# EAGLE design extruder-controller (EAGLE 5.06)
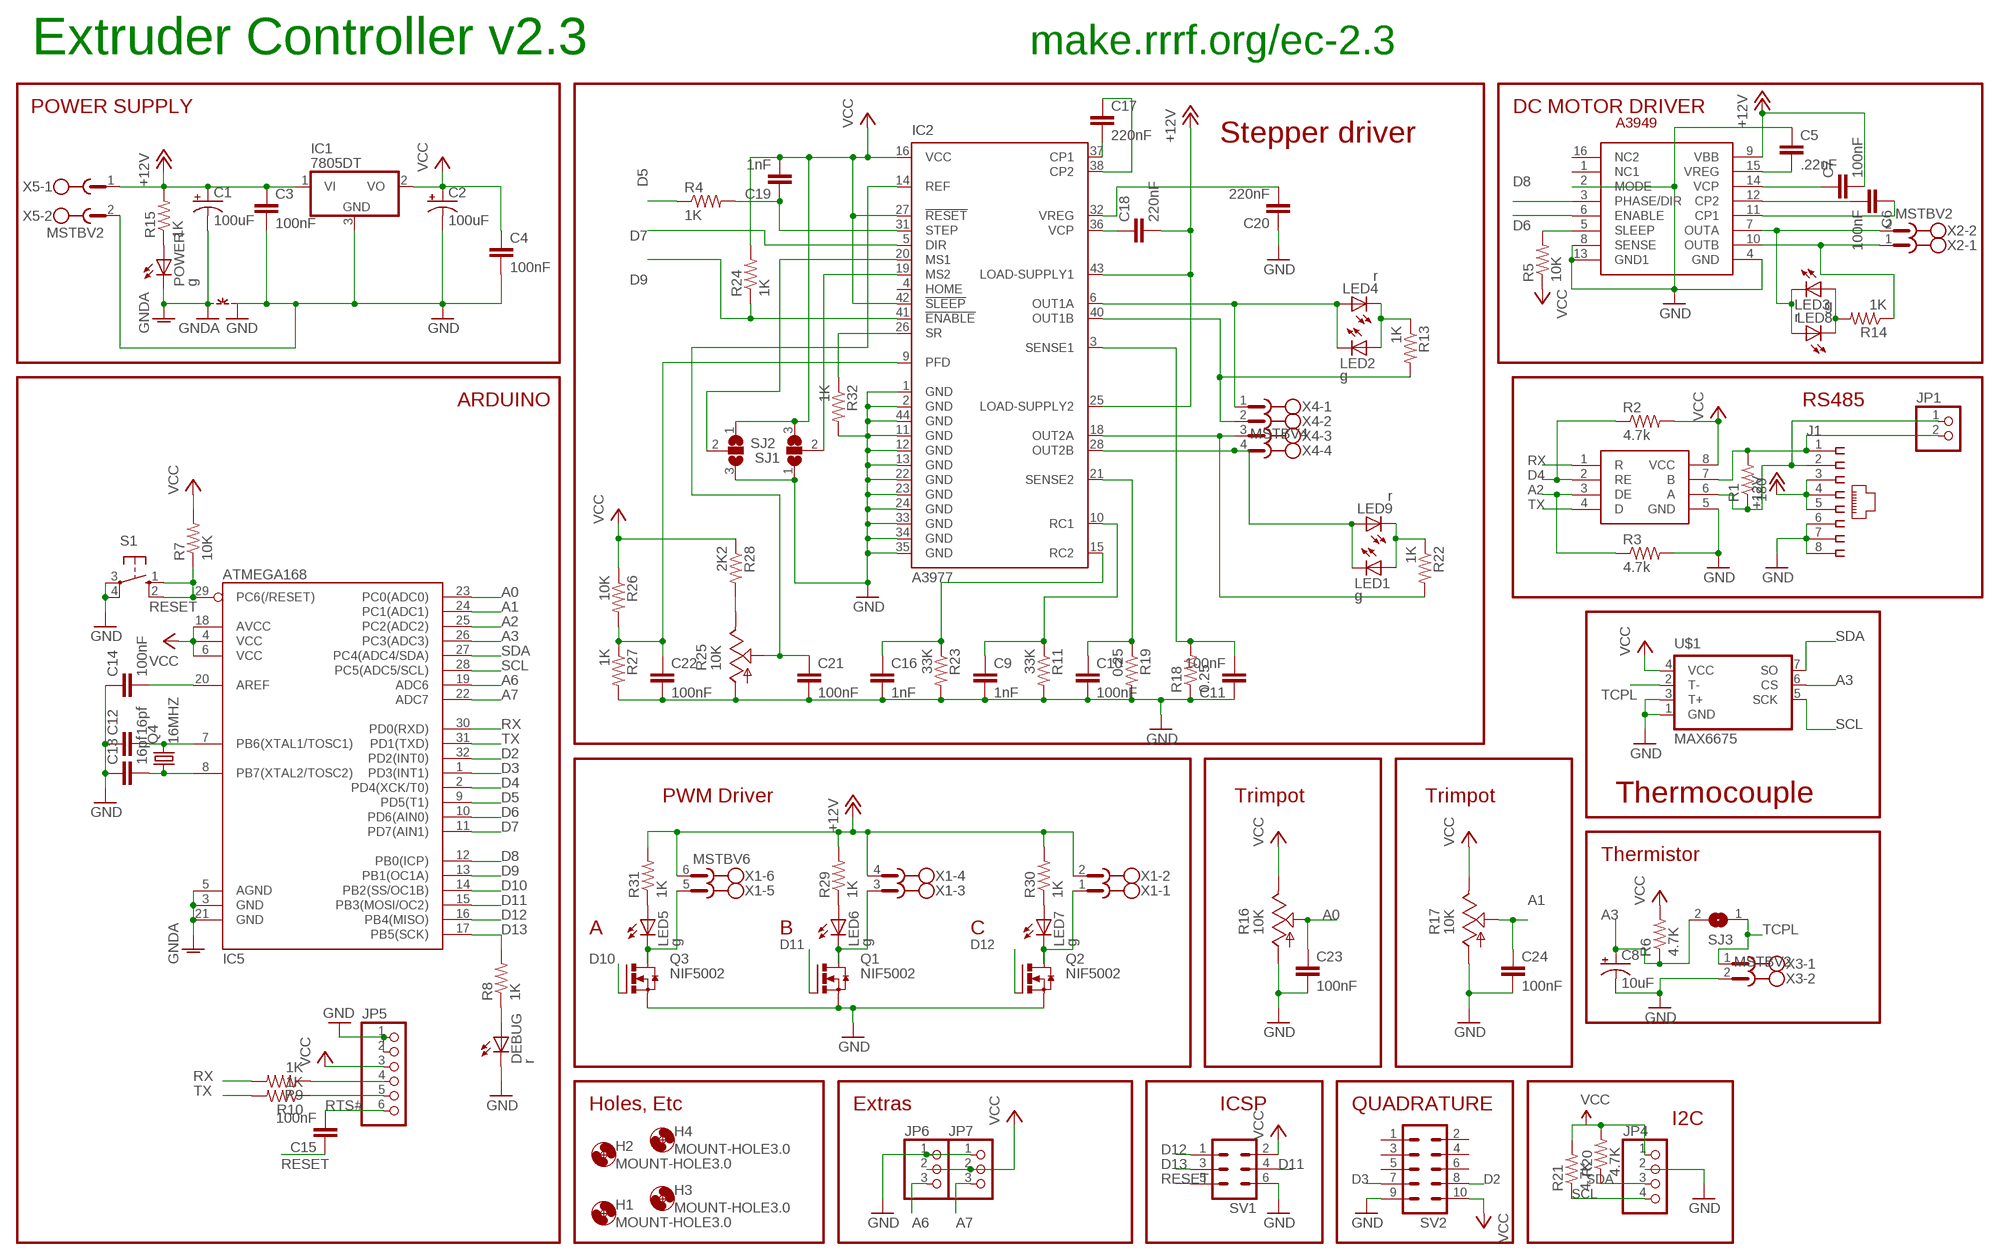
[diagram p0: schematic, sheet 1]

## Parts
C1  100uF  CPOL-USUD-10X10  [UD-10X10_NICHICON]
C2  100uF  CPOL-USUD-10X10  [UD-10X10_NICHICON]
C3  100nF  C-EUC1206  [C1206]
C4  100nF  C-EUC1206  [C1206]
C5  .22uF  C-EUC1206K  [C1206K]
C6  100nF  C-EUC1206K  [C1206K]
C7  100nF  C-EUC1206K  [C1206K]
C8  10uF  CPOL-USUD-6,3X5,8  [UD-6,3X5,8_NICHICON]
C9  1nF  C-EUC1206K  [C1206K]
C10  100nF  C-EUC1206K  [C1206K]
C11  100nF  C-EUC1206K  [C1206K]
C12  16pf  C-EUC1206  [C1206]
C13  16pf  C-EUC1206  [C1206]
C14  100nF  C-EUC1206  [C1206]
C15  100nF  C-EUC1206  [C1206]
C16  1nF  C-EUC1206K  [C1206K]
C17  220nF  C-EUC1206K  [C1206K]
C18  220nF  C-EUC1206K  [C1206K]
C19  1nF  C-EUC1206K  [C1206K]
C20  220nF  C-EUC1206K  [C1206K]
C21  100nF  C-EUC1206K  [C1206K]
C22  100nF  C-EUC1206K  [C1206K]
C23  100nF  C-EUC1206K  [C1206K]
C24  100nF  C-EUC1206K  [C1206K]
DEBUG  r  LEDCHIPLED_1206  [CHIPLED_1206]
H1  MOUNT-HOLE3.0  [3,0]
H2  MOUNT-HOLE3.0  [3,0]
H3  MOUNT-HOLE3.0  [3,0]
H4  MOUNT-HOLE3.0  [3,0]
IC1  7805DT  [TO252]
IC2  A3977  [PLCC44]
IC3  A3949  [SO16W]
IC4  SN75176ASOIC  [SO08]
IC5  ATMEGA168  [TQFP32-08]
J1  520426-4  [520426-4]
JP1  PINHD-1X2  [1X02]
JP4  PINHD-1X4  [1X04]
JP5  PINHD-1X6  [1X06]
JP6  PINHD-1X3  [1X03]
JP7  PINHD-1X3  [1X03]
LED1  g  LEDCHIPLED_1206  [CHIPLED_1206]
LED2  g  LEDCHIPLED_1206  [CHIPLED_1206]
LED3  r  LEDCHIPLED_1206  [CHIPLED_1206]
LED4  r  LEDCHIPLED_1206  [CHIPLED_1206]
LED5  g  LEDCHIPLED_1206  [CHIPLED_1206]
LED6  g  LEDCHIPLED_1206  [CHIPLED_1206]
LED7  g  LEDCHIPLED_1206  [CHIPLED_1206]
LED8  g  LEDCHIPLED_1206  [CHIPLED_1206]
LED9  r  LEDCHIPLED_1206  [CHIPLED_1206]
POWER  g  LEDCHIPLED_1206  [CHIPLED_1206]
Q1  NIF5002  N-HEXFET-2D_SOT232-  [SOT223]
Q2  NIF5002  N-HEXFET-2D_SOT232-  [SOT223]
Q3  NIF5002  N-HEXFET-2D_SOT232-  [SOT223]
Q4  16MHZ  CRYSTALHC49S  [HC49/S]
R1  180  R-US_R1206  [R1206]
R2  4.7k  R-US_R1206  [R1206]
R3  4.7k  R-US_R1206  [R1206]
R4  1K  R-US_R1206  [R1206]
R5  10K  R-US_R1206  [R1206]
R6  4.7K  R-US_M1206  [M1206]
R7  10K  R-US_R1206  [R1206]
R8  1K  R-US_R1206  [R1206]
R9  1K  R-US_R1206  [R1206]
R10  1K  R-US_R1206  [R1206]
R11  33K  R-US_R1206  [R1206]
R13  1K  R-US_R1206  [R1206]
R14  1K  R-US_R1206  [R1206]
R15  1K  R-US_R1206  [R1206]
R16  10K  TRIM_US-B25P  [B25P]
R17  10K  TRIM_US-B25P  [B25P]
R18  0.25  R-US_R2512  [R2512]
R19  0.25  R-US_R2512  [R2512]
R20  4.7K  R-US_R1206  [R1206]
R21  4.7K  R-US_R1206  [R1206]
R22  1K  R-US_R1206  [R1206]
R23  33K  R-US_R1206  [R1206]
R24  1K  R-US_R1206  [R1206]
R25  10K  TRIM_US-B25P  [B25P]
R26  10K  R-US_R1206  [R1206]
R27  1K  R-US_R1206  [R1206]
R28  2K2  R-US_R1206  [R1206]
R29  1K  R-US_R1206  [R1206]
R30  1K  R-US_R1206  [R1206]
R31  1K  R-US_M1206  [M1206]
R32  1K  R-US_R1206  [R1206]
S1  10-XX  [B3F-10XX]
SJ1  SJ2W  [SJ_2]
SJ2  SJ2W  [SJ_2]
SJ3  SJ  [SJ]
SV1  ML6  [ML6]
SV2  ML10  [ML10]
U$1  MAX6675  [SO08]
X1  MSTBV6  [MSTBV6]
X2  MSTBV2  [MSTBV2]
X3  MSTBV2  [MSTBV2]
X4  MSTBV4  [MSTBV4]
X5  MSTBV2  [MSTBV2]
~NUDEV~1  GND-GNDA  [GND-GNDA]

## Nets
+12V [power]: C1.+ C3.1 C7.2 C18.2 IC1.1(VI) IC2.25(LOAD-SUPPLY2) IC2.43(LOAD-SUPPLY1) IC3.9(VBB) J1.3 J1.4 J1.5 R15.2 R29.2 R30.2 R31.2 X1.2 X1.4 X1.6 X5.1
A0: C23.1 IC5.23(PC0(ADC0)) R16.S
A1: C24.1 IC5.24(PC1(ADC1)) R17.S
A2: IC4.3(DE) IC5.25(PC2(ADC2)) R3.1
A3: C8.+ IC5.26(PC3(ADC3)) R6.1 SJ3.2 U$1.6(CS)
A6: IC5.19(ADC6) JP6.3
A7: IC5.22(ADC7) JP7.3
D2: IC5.32(PD2(INT0)) SV2.8
D3: IC5.1(PD3(INT1)) SV2.7
D4: IC4.2(RE) IC5.2(PD4(XCK/T0)) R2.1
D5: IC5.9(PD5(T1)) R4.1
D6: IC3.6(ENABLE) IC5.10(PD6(AIN0))
D7: IC2.5(DIR) IC5.11(PD7(AIN1))
D8: IC3.3(PHASE/DIR) IC5.12(PB0(ICP))
D9: IC2.41(!ENABLE) IC5.13(PB1(OC1A)) R24.1
D10: IC5.14(PB2(SS/OC1B)) Q3.1(G)
D11: IC5.15(PB3(MOSI/OC2)) Q1.1(G) SV1.4
D12: IC5.16(PB4(MISO)) Q2.1(G) SV1.1
D13: IC5.17(PB5(SCK)) R8.2 SV1.3
GND [power]: C2.- C3.2 C4.2 C5.1 C8.- C9.2 C10.2 C11.1 C12.1 C13.1 C14.1 C16.2 C20.1 C21.2 C22.2 C23.2 C24.2 DEBUG.C IC1.3(GND) IC2.1(GND) IC2.2(GND) IC2.11(GND) IC2.12(GND) IC2.13(GND) IC2.22(GND) IC2.23(GND) IC2.24(GND) IC2.33(GND) IC2.34(GND) IC2.35(GND) IC2.44(GND) IC3.2(MODE) IC3.4(GND) IC3.8(SENSE) IC3.13(GND1) IC4.5(GND) J1.6 J1.7 J1.8 JP4.2 JP5.1 JP5.2 JP6.1 JP7.1 Q1.3(S) Q2.3(S) Q3.3(S) R3.2 R11.2 R16.A R17.A R18.1 R19.2 R23.2 R25.A R27.2 R32.2 S1.3(P) S1.4(P1) SJ1.1 SJ2.3 SV1.6 SV2.9 U$1.1(GND) U$1.3(T+) X3.2 X5.2 ~NUDEV~1.GND
GNDA: C1.- IC5.3(GND) IC5.5(AGND) IC5.21(GND) POWER.C ~NUDEV~1.GNDA
N$1: IC4.7(B) J1.1 JP1.2 R1.2
N$2: IC4.6(A) J1.2 JP1.1 R1.1
N$3 [motors]: IC2.6(OUT1A) LED2.C LED4.A X4.1
N$4 [motors]: IC2.40(OUT1B) R13.2 X4.2
N$5: C19.1 IC2.31(STEP) R4.2
N$6 [power]: IC3.7(OUTA) LED3.C LED8.A X2.2
N$7: LED2.A LED4.C R13.1
N$8: DEBUG.A R8.1
N$9: C9.1 IC2.10(RC1) R11.1
N$11: C5.2 IC3.15(VREG)
N$12: C16.1 IC2.15(RC2) R23.1
N$13: C6.2 IC3.12(CP2)
N$14: C6.1 IC3.11(CP1)
N$15: C7.1 IC3.14(VCP)
N$16: IC3.5(SLEEP) R5.2
N$17 [motors]: IC3.10(OUTB) R14.1 X2.1
N$18 [motors]: C11.2 IC2.3(SENSE1) R18.2
N$20: C14.2 IC5.20(AREF)
N$21: JP5.5 R10.1
N$22: JP5.4 R9.1
N$23: LED1.A LED9.C R22.1
N$24: LED3.A LED8.C R14.2
N$25: POWER.A R15.1
N$26 [motors]: IC2.28(OUT2B) LED1.C LED9.A X4.4
N$27 [motors]: IC2.18(OUT2A) R22.2 X4.3
N$28: IC2.26(SR) R32.1
N$30 [motors]: C10.1 IC2.21(SENSE2) R19.1
N$31: C12.2 IC5.7(PB6(XTAL1/TOSC1)) Q4.2
N$32: C13.2 IC5.8(PB7(XTAL2/TOSC2)) Q4.1
N$33 [power]: LED7.C Q2.2(D) Q2.4(D) X1.1
N$34 [power]: LED6.C Q1.2(D) Q1.4(D) X1.3
N$35 [power]: LED5.C Q3.2(D) Q3.4(D) X1.5
N$36: C18.1 IC2.36(VCP)
N$37: C20.2 IC2.32(VREG)
N$38: C17.2 IC2.37(CP1)
N$39: C17.1 IC2.38(CP2)
N$41: LED5.A R31.1
N$42: LED6.A R29.1
N$43: LED7.A R30.1
N$45: C22.1 IC2.9(PFD) R26.2 R27.1
N$46: IC2.19(MS2) SJ1.2
N$47: IC2.20(MS1) SJ2.2
N$48: R25.E R28.2
N$49: C21.1 IC2.14(REF) R25.S
RESET: C15.1 IC5.29(PC6(/RESET)) R7.1 S1.1(S) S1.2(S1) SV1.5
RTS#: C15.2 JP5.6
RX: IC4.1(R) IC5.30(PD0(RXD)) R9.2
SCL: IC5.28(PC5(ADC5/SCL)) JP4.4 R21.1 U$1.5(SCK)
SDA: IC5.27(PC4(ADC4/SDA)) JP4.3 R20.1 U$1.7(SO)
TCPL: SJ3.1 U$1.2(T-) X3.1
TX: IC4.4(D) IC5.31(PD1(TXD)) R10.2
VCC: C2.+ C4.1 C19.2 IC1.2(VO) IC2.16(VCC) IC2.27(!RESET) IC2.42(!SLEEP) IC4.8(VCC) IC5.4(VCC) IC5.6(VCC) IC5.18(AVCC) JP4.1 JP5.3 JP6.2 JP7.2 R2.2 R5.1 R6.2 R7.2 R16.E R17.E R20.2 R21.2 R24.2 R26.1 R28.1 SJ1.3 SJ2.1 SV1.2 SV2.10 U$1.4(VCC)
Unconnected: IC2.4(HOME) IC3.1(NC1) IC3.16(NC2) SV2.1 SV2.2 SV2.3 SV2.4 SV2.5 SV2.6

## Notes on the sheet
- make.rrrf.org/ec-2.3
- Extruder Controller v2.3
- POWER SUPPLY | DC MOTOR DRIVER
- Stepper driver
- ARDUINO | RS485
- PWM Driver | Trimpot | Trimpot | Thermocouple
- Thermistor
- A | B | C
- Holes, Etc | Extras | ICSP | QUADRATURE | I2C

## Library data of the parts
C1 C2 C8 = rcl:CPOL-US: POLARIZED CAPACITOR, American symbol
C3-C7 C9-C11 C14 C16-C24 = rcl:C-EU: CAPACITOR, European symbol
C12 C13 C15 = resistor:C-EU: CAPACITOR, European symbol
DEBUG LED1-LED9 POWER = led:LED: LED OSRAM: - CHIPLED LG R971, LG N971, LY N971, LG Q971, LY Q971, LO R971, LY R971 LH N974, LH R974 LS Q976, LO Q976, LY Q976 LO Q996 - Hyper CHIPLED LW Q18S LB Q993, LB Q99A, LB R99A - SideLED LS A670, LO A670, LY A670, LG A670, LP A670 LB A673, LV A673, LT A673, LW A673 LH A674 LY A675 LS A676, LA A676, LO A676, LY A676, LW A676 LS A679, LY A679, LG A679 - Hyper Micro SIDELED® LS Y876, LA Y876, LO Y876, LY Y876 LT Y87S - SmartLED LW L88C, LW L88S LB L89C, LB L89S, LG L890 LS L89K, LO L89K, LY L89K LS L896, LA L896, LO L896, LY L896 - TOPLED LS T670, LO T670, LY T670, LG T670, LP T670 LSG T670, LSP T670, LSY T670, LOP T670, LYG T670 LG T671, LOG T671, LSG T671 LB T673, LV T673, LT T673, LW T673 LH T674 LS T676, LA T676, LO T676, LY T676, LB T676, LH T676, LSB T676, LW T676 LB T67C, LV T67C, LT T67C, LS T67K, LO T67K, LY T67K, LW E67C LS E67B, LA E67B, LO E67B, LY E67B, LB E67C, LV E67C, LT E67C LW T67C LS T679, LY T679, LG T679 LS T770, LO T770, LY T770, LG T770, LP T770 LB T773, LV T773, LT T773, LW T773 LH T774 LS E675, LA E675, LY E675, LS T675 LS T776, LA T776, LO T776, LY T776, LB T776 LHGB T686 LT T68C, LB T68C - Hyper Mini TOPLED® LB M676 - Mini TOPLED Santana® LG M470 LS M47K, LO M47K, LY M47K Source: http://www.osram.convergy.de - LUMILED® LXK2-PW12-R00, LXK2-PW12-S00, LXK2-PW14-U00, LXK2-PW14-V00 LXK2-PM12-R00, LXK2-PM12-S00, LXK2-PM14-U00 LXK2-PE12-Q00, LXK2-PE12-R00, LXK2-PE12-S00, LXK2-PE14-T00, LXK2-PE14-U00 LXK2-PB12-K00, LXK2-PB12-L00, LXK2-PB12-M00, LXK2-PB14-N00, LXK2-PB14-P00, LXK2-PB14-Q00 LXK2-PR12-L00, LXK2-PR12-M00, LXK2-PR14-Q00, LXK2-PR14-R00 LXK2-PD12-Q00, LXK2-PD12-R00, LXK2-PD12-S00 LXK2-PH12-R00, LXK2-PH12-S00 LXK2-PL12-P00, LXK2-PL12-Q00, LXK2-PL12-R00 Source: www.luxeon.com
H1-H4 = holes:MOUNT-HOLE: MOUNTING HOLE with drill center marker
IC1 = linear:78*: Positive VOLTAGE REGULATOR Source: http://cache.national.com/ds/LM/LM78L05.pdf http://www.fairchildsemi.com/ds/LM/LM7805.pdf
IC2 = allegro:A3977: MICROSTEPPING DMOS DRIVER WITH TRANSLATOR Source: 3977.pdf
IC3 = reprap:A3949
IC4 = reprap:SN75176A
IC5 = SparkFun:ATMEGA168
J1 = con-amp:520426-4: AMP connector
JP1 = pinhead:PINHD-1X2: PIN HEADER
JP4 = pinhead:PINHD-1X4: PIN HEADER
JP5 = pinhead:PINHD-1X6: PIN HEADER
JP6 JP7 = pinhead:PINHD-1X3: PIN HEADER
Q1-Q3 = transistor-power:N-HEXFET-2D_?-*: HEXFET® Power MOSFET 2 Drain connects http://www.irf.com/product-info/datasheets/data/irll014n.pdf
Q4 = crystal:CRYSTAL: CRYSTAL
R1-R3 R5 R7-R10 R15 = resistor:R-US_: RESISTOR, American symbol
R4 R6 R11 R13 R14 R18-R24 R26-R32 = rcl:R-US_: RESISTOR, American symbol
R16 R17 R25 = pot:TRIM_US-: POTENTIOMETER
S1 = switch-omron:10-XX: OMRON SWITCH
SJ1 SJ2 = jumper:SJ2W: SMD solder JUMPER
SJ3 = jumper:SJ: SMD solder JUMPER
SV1 = con-harting-ml:ML6: HARTING
SV2 = con-harting-ml:ML10: HARTING
U$1 = reprap:MAX6675: K-type thermocouple amplifier and a->d converter
X1 = con-phoenix-508:MSTBV6: PHOENIX
X2 X3 X5 = con-phoenix-508:MSTBV2: PHOENIX
X4 = con-phoenix-508:MSTBV4: PHOENIX
~NUDEV~1 = supply1:GND-GNDA: Example of GND--GNDA NET-Connetor for more info see description in package

## Net classes
0 default: width 0.305 mm
1 power: width 1.27 mm
2 motors: width 0.762 mm

## Board
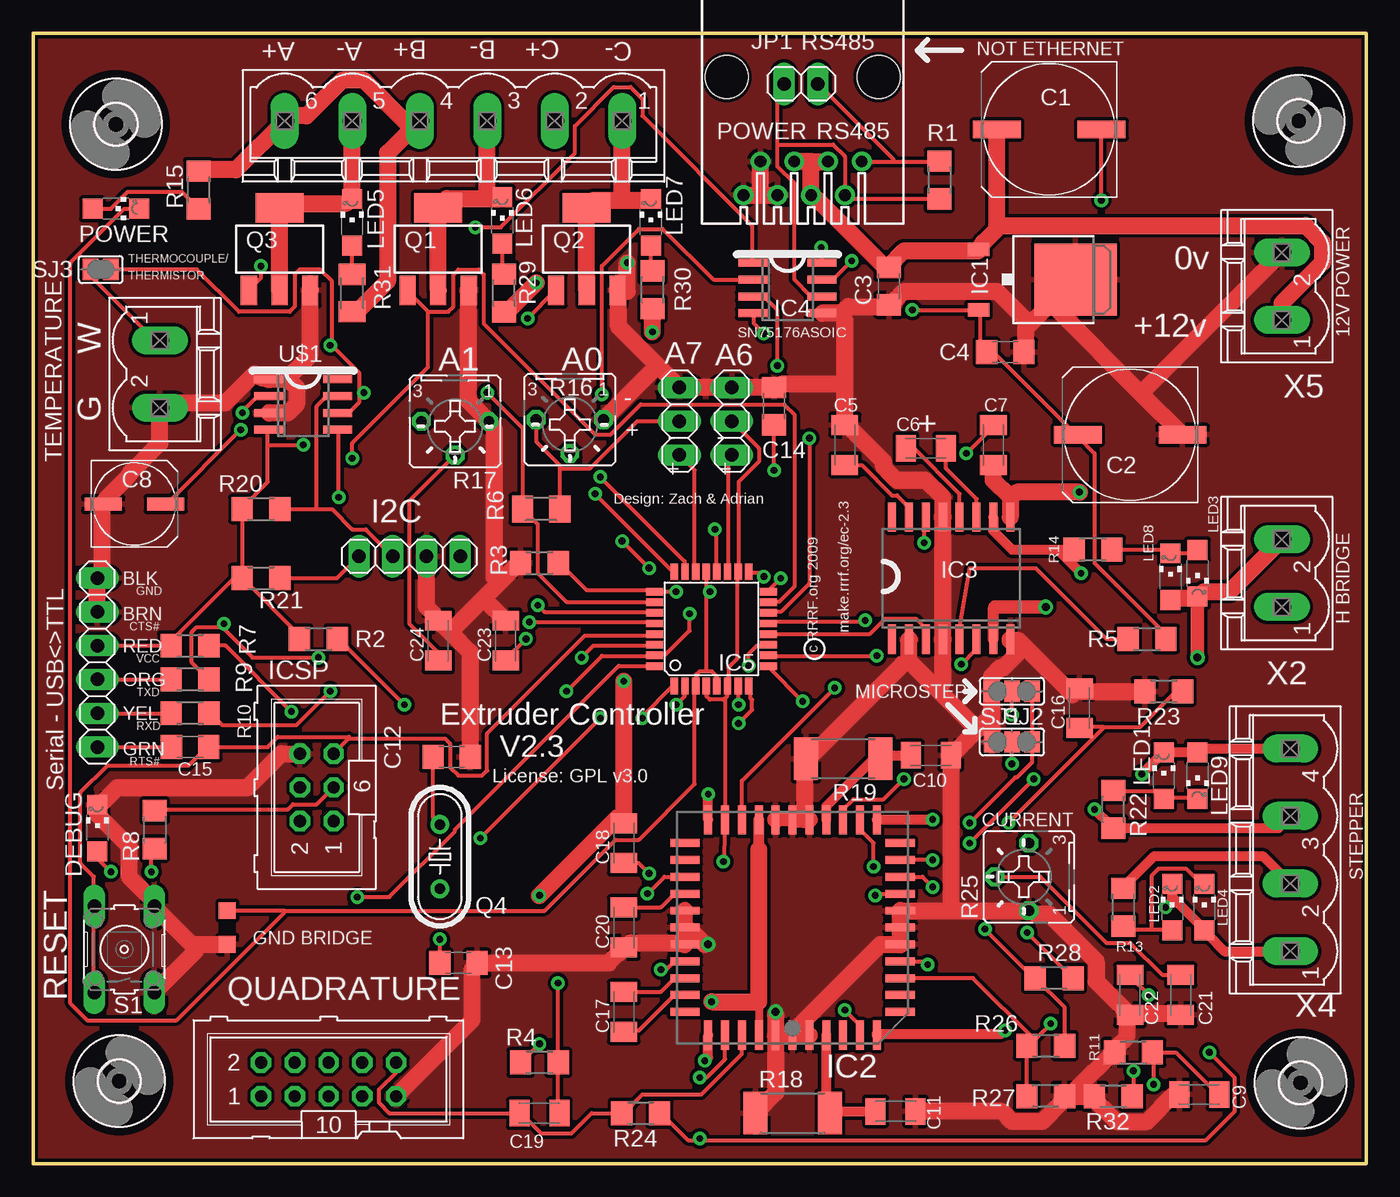
[diagram p1: board, top side]
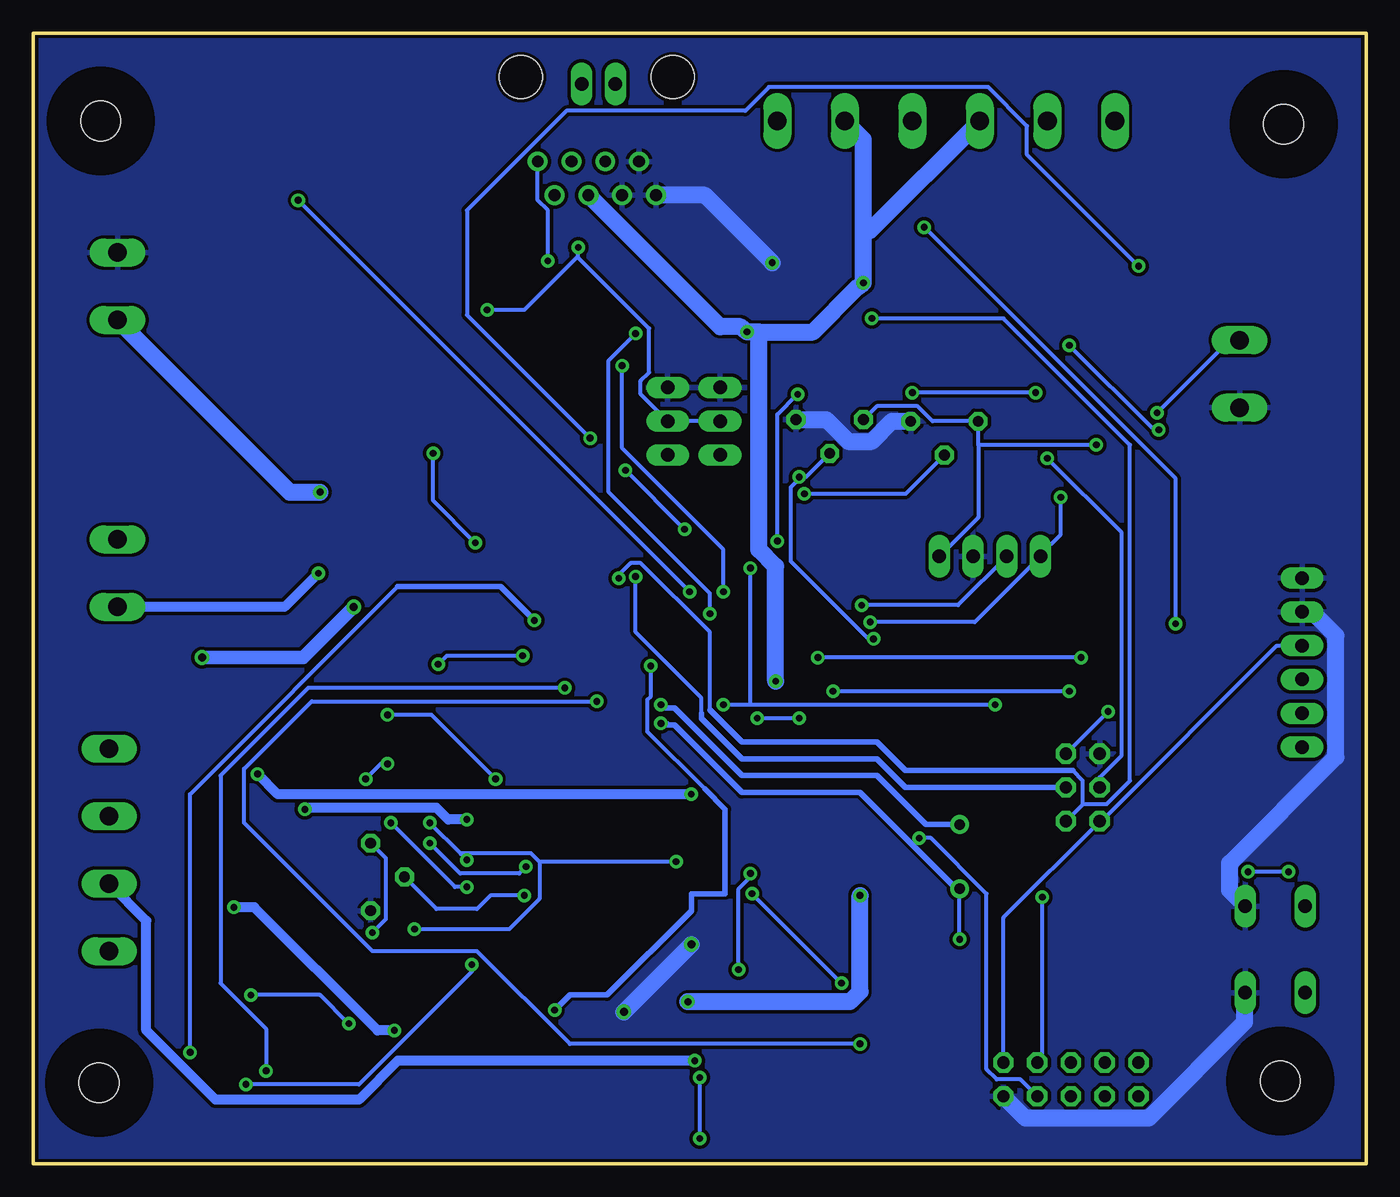
[diagram p2: board, bottom side, seen from below]

Size 100.33 x 85.09 mm. Coordinates in mm from the lower left corner, seen from the top.
Outline: 0,85.09 100.33,85.09 100.33,0 0,0 0,85.09
Copper layers (1*16): Top 0.035mm / dielectric 1.5mm / Bottom 0.035mm
Design rules "reprap": minimum track width 8mil, minimum drill 20mil, track to track 10mil, track to pad 10mil, pad to pad 10mil, via to via 10mil, smd to smd 8mil, copper to edge 10mil, drill to drill 8mil, minimum pad ring 12mil, minimum via ring 10mil, stop-mask expansion 4mil, vias tented up to drill 25mil, thermal gap 10mil

### Footprints (pad centres in the part's own frame; a part is rotated, then mirrored left to right if it is on the bottom)
UD-10X10_NICHICON = smd 3.6 x 1.3: + 3.925,0; - -3.95,0
C1206 = smd 1.6 x 1.8: 1 -1.4,0; 2 1.4,0
C1206K = smd 1.5 x 2: 1 -1.5,0; 2 1.5,0
UD-6,3X5,8_NICHICON = smd 2.8 x 1: + 2.35,0; - -2.35,0
CHIPLED_1206 = smd 1.5 x 1.5: A 0,-1.75; C 0,1.75
3,0 = hole 3: 0,0
TO252 = smd 1 x 1.6: 1 -2.28,-4.8; 2 2.28,-4.8 | smd 5.4 x 6.2: 3 0,2.5
PLCC44 = smd 0.6 x 2.2: 1 0,8.1; 2 -1.27,8.1; 3 -2.54,8.1; 4 -3.81,8.1; 5 -5.08,8.1; 6 -6.35,8.1; 18 -6.35,-8.1; 19 -5.08,-8.1; 20 -3.81,-8.1; 21 -2.54,-8.1; 22 -1.27,-8.1; 23 0,-8.1; 24 1.27,-8.1; 25 2.54,-8.1; 26 3.81,-8.1; 27 5.08,-8.1; 28 6.35,-8.1; 40 6.35,8.1; 41 5.08,8.1; 42 3.81,8.1; 43 2.54,8.1; 44 1.27,8.1 | smd 2.2 x 0.6: 7 -8.1,6.35; 8 -8.1,5.08; 9 -8.1,3.81; 10 -8.1,2.54; 11 -8.1,1.27; 12 -8.1,0; 13 -8.1,-1.27; 14 -8.1,-2.54; 15 -8.1,-3.81; 16 -8.1,-5.08; 17 -8.1,-6.35; 29 8.1,-6.35; 30 8.1,-5.08; 31 8.1,-3.81; 32 8.1,-2.54; 33 8.1,-1.27; 34 8.1,0; 35 8.1,1.27; 36 8.1,2.54; 37 8.1,3.81; 38 8.1,5.08; 39 8.1,6.35
SO16W = smd 0.6 x 2.2: 1 -4.445,-4.6; 2 -3.175,-4.6; 3 -1.905,-4.6; 4 -0.635,-4.6; 5 0.635,-4.6; 6 1.905,-4.6; 7 3.175,-4.6; 8 4.445,-4.6; 9 4.445,4.6; 10 3.175,4.6; 11 1.905,4.6; 12 0.635,4.6; 13 -0.635,4.6; 14 -1.905,4.6; 15 -3.175,4.6; 16 -4.445,4.6
SO08 = smd 0.6 x 2.2: 1 -1.905,-2.6; 2 -0.635,-2.6; 3 0.635,-2.6; 4 1.905,-2.6; 5 1.905,2.6; 6 0.635,2.6; 7 -0.635,2.6; 8 -1.905,2.6
TQFP32-08 = smd 1.27 x 0.559: 1 -4.293,2.8; 2 -4.293,2; 3 -4.293,1.2; 4 -4.293,0.4; 5 -4.293,-0.4; 6 -4.293,-1.2; 7 -4.293,-2; 8 -4.293,-2.8; 17 4.293,-2.8; 18 4.293,-2; 19 4.293,-1.2; 20 4.293,-0.4; 21 4.293,0.4; 22 4.293,1.2; 23 4.293,2; 24 4.293,2.8 | smd 0.559 x 1.27: 9 -2.8,-4.293; 10 -2,-4.293; 11 -1.2,-4.293; 12 -0.4,-4.293; 13 0.4,-4.293; 14 1.2,-4.293; 15 2,-4.293; 16 2.8,-4.293; 25 2.8,4.293; 26 2,4.293; 27 1.2,4.293; 28 0.4,4.293; 29 -0.4,4.293; 30 -1.2,4.293; 31 -2,4.293; 32 -2.8,4.293
520426-4 = drill 0.889 round: 1 -4.445,6.35; 2 -3.175,8.89; 3 -1.905,6.35; 4 -0.635,8.89; 5 0.635,6.35; 6 1.905,8.89; 7 3.175,6.35; 8 4.445,8.89 | hole 3.251: -5.715,0; 5.715,0
1X02 = drill 1.016 long: 1 -1.27,0; 2 1.27,0
1X04 = drill 1.016 long: 1 -3.81,0; 2 -1.27,0; 3 1.27,0; 4 3.81,0
1X06 = drill 1.016 long: 1 -6.35,0; 2 -3.81,0; 3 -1.27,0; 4 1.27,0; 5 3.81,0; 6 6.35,0
1X03 = drill 1.016 long: 1 -2.54,0; 2 0,0; 3 2.54,0
SOT223 = smd 1.219 x 2.235: 1 -2.311,-3.099; 2 0,-3.099; 3 2.311,-3.099 | smd 3.6 x 2.2: 4 0,3.099
HC49/S = drill 0.813 round: 1 -2.413,0; 2 2.413,0
R1206 = smd 1.6 x 1.803: 1 -1.422,0; 2 1.422,0
M1206 = smd 1.6 x 2: 1 -1.4,0; 2 1.4,0
B25P = drill 0.813 octagon: A -2.54,0; E 2.54,0; S 0,2.54
R2512 = smd 1.8 x 3.2: 1 -2.8,0; 2 2.8,0
B3F-10XX = drill 1.016 long: 1 -3.251,2.261; 2 3.251,2.261; 3 -3.251,-2.261; 4 3.251,-2.261
SJ_2 = smd 1.168 x 1.6: 1 -1.524,0; 2 0,0; 3 1.524,0
SJ = smd 1.168 x 1.6: 1 -0.762,0; 2 0.762,0
ML6 = drill 0.914 octagon: 1 -2.54,-1.27; 2 -2.54,1.27; 3 0,-1.27; 4 0,1.27; 5 2.54,-1.27; 6 2.54,1.27
ML10 = drill 0.914 octagon: 1 -5.08,-1.27; 2 -5.08,1.27; 3 -2.54,-1.27; 4 -2.54,1.27; 5 0,-1.27; 6 0,1.27; 7 2.54,-1.27; 8 2.54,1.27; 9 5.08,-1.27; 10 5.08,1.27
MSTBV6 = drill 1.397 long: 1 -12.7,0; 2 -7.62,0; 3 -2.54,0; 4 2.54,0; 5 7.62,0; 6 12.7,0
MSTBV2 = drill 1.397 long: 1 -2.54,0; 2 2.54,0
MSTBV4 = drill 1.397 long: 1 -7.62,0; 2 -2.54,0; 3 2.54,0; 4 7.62,0
GND-GNDA = smd 1.27 x 1.27: GND -1.27,0; GNDA 1.27,0

### Placement (x,y rotation side)
C1  76.45,77.85 180 top
C2  82.55,54.86 180 top
C3  64.39,66.04 270 top
C4  73.15,61.09 0 top
C5  61.09,54.1 270 top
C6  67.18,53.85 180 top
C7  72.26,54.1 270 top
C8  7.62,49.66 0 top
C9  87.76,5.21 180 top
C10  67.56,30.73 0 top
C11  64.9,3.94 180 top
C12  31.5,30.61 180 top
C13  32,15.11 180 top
C14  55.75,57.02 270 top
C15  11.81,31.37 180 top
C16  78.74,34.29 90 top
C17  44.45,11.43 90 top
C18  44.45,24.13 90 top
C19  38.1,3.81 180 top
C20  44.45,17.78 90 top
C21  86.36,12.7 270 top
C22  82.55,12.7 270 top
C23  35.56,39.37 90 top
C24  30.48,39.37 90 top
DEBUG  4.83,25.27 0 top
H1  6.48,6.22 0 top
H2  6.22,78.23 0 top
H3  95.38,6.1 0 top
H4  95.25,78.49 90 top
IC1  75.95,66.55 270 top
IC2  57.15,17.78 180 top
IC3  69.09,44.07 0 top
IC4  56.77,65.91 270 top
IC5  51.05,40.26 90 top
J1  57.91,81.79 180 top
JP1  57.79,81.28 0 top
JP4  28.32,45.72 180 top
JP5  4.83,37.72 270 top
JP6  52.58,55.88 270 top
JP7  48.64,55.88 270 top
LED1  85.09,29.21 0 top
LED2  85.72,19.3 0 top
LED3  87.63,44.45 180 top
LED4  88.14,19.3 0 top
LED5  24,70.87 0 top
LED6  35.31,70.99 0 top
LED7  46.48,70.87 0 top
LED8  85.6,44.2 0 top
LED9  87.63,29.21 180 top
POWER  6.22,71.88 270 top
Q1  30.48,68.83 0 top
Q2  41.66,68.83 0 top
Q3  18.54,68.83 0 top
Q4  30.61,23.11 90 top
R1  68.2,74.04 90 top
R2  21.46,39.5 180 top
R3  38.1,45.21 180 top
R4  38.1,7.62 0 top
R5  83.82,39.5 180 top
R6  38.23,49.28 0 top
R7  11.81,38.99 180 top
R8  9.14,25.15 90 top
R9  11.81,36.45 0 top
R10  11.81,33.91 0 top
R11  82.8,8.38 180 top
R13  82.04,19.3 90 top
R14  79.76,46.23 0 top
R15  12.45,73.28 90 top
R16  40.39,56.01 180 top
R17  31.75,55.88 180 top
R18  57.15,3.81 0 top
R19  60.96,30.48 180 top
R20  17.14,49.28 180 top
R21  17.14,44.07 180 top
R22  81.28,26.67 270 top
R23  85.09,35.56 180 top
R24  45.72,3.81 180 top
R25  74.93,21.59 90 top
R26  76.2,8.89 180 top
R27  76.2,5.08 0 top
R28  76.83,13.97 0 top
R29  35.43,65.53 270 top
R30  46.61,65.79 270 top
R31  24,65.53 270 top
R32  81.28,5.08 180 top
S1  6.86,16.13 90 top
SJ1  73.66,31.75 0 top
SJ2  73.66,35.56 180 top
SJ3  5.08,67.31 0 top
SV1  21.34,28.32 90 top
SV2  22.22,6.35 0 top
U$1  20.32,57.15 270 top
X1  31.62,78.49 180 top
X2  93.98,44.45 90 top
X3  9.53,59.44 270 top
X4  94.61,23.62 90 top
X5  93.98,66.04 90 top
~NUDEV~1  14.61,17.78 90 top

### Tracks (layer width: path | path; a pad name or v marks a point on that pad's centre or on a via)
+12V  (via drill 0.51)
  Top 0.61: 54.61,12.19 IC2.43
  Top 0.813: 54.61,23.62 IC2.25
  Top 1.27: 73.53,50.17 72.26,51.44 C7.2 | 73.53,50.17 IC3.9 | v78.74,50.55 74.04,50.55 73.53,50.17 | R15.2 12.45,74.8 15.24,74.8 X1.6 19.43,78.87 20.57,78.87 23.24,81.53 24.89,81.53 28.07,78.36 X1.4 26.67,76.07 26.67,66.42 24.38,64.14 R31.2 | 58.55,75.44 J1.3 | 58.55,75.44 J1.5 | 58.55,75.44 J1.4 59.05,72.52 63.88,67.69 C3.1 64.39,67.56 65.53,68.71 71.12,68.71 IC1.1 71.5,69.34 72.52,70.36 72.52,70.61 | 72.52,70.61 72.52,77.85 C1.+ | v37.85,66.29 35.69,64.14 35.43,64.14 R29.2 | v46.61,62.61 R30.2 | v44.45,36.32 C18.2 43.94,26.04 v38.1,20.19 | X5.1 93.98,64.77 97.03,67.82 97.03,69.34 95.76,70.61 72.52,70.61 | v51.05,12.19 54.61,12.19 54.61,23.62
  Bottom 1.27: v78.74,50.55 81.03,50.55 X5.1 | 37.85,70.23 37.85,77.09 X1.2 | 37.85,70.23 v37.85,66.29 38.35,65.91 41.66,62.61 45.72,62.61 | 45.72,62.61 v46.61,62.61 47.12,62.99 48.64,62.99 J1.4 | v44.45,36.32 44.45,44.96 45.72,46.23 45.72,62.61 | X1.4 37.34,70.23 37.85,70.23 | v51.05,12.19 38.86,12.19 38.1,12.95 v38.1,20.19
A0  (via drill 0.51)
  Top 0.305: v42.67,51.69 49.02,45.34 49.02,44.58 IC5.23 | v37.08,39.5 35.56,37.97 C23.1
  Bottom 0.305: R16.S 42.16,51.69 v42.67,51.69 42.67,51.56 43.31,50.93 43.31,45.34 37.47,39.5 v37.08,39.5
A1  (via drill 0.51)
  Top 0.305: v42.29,50.42 48.13,44.58 IC5.24 | R17.S 28.32,49.91 28.32,40.64 30.48,38.48 C24.1
  Bottom 0.305: v42.29,50.42 34.67,50.42 R17.S
A2  (via drill 0.51)
  Top 0.305: R3.1 39.62,45.21 41.66,43.18 46.74,43.18 IC5.25 46.86,43.05 v48.39,43.05 | v56.01,60.07 56.01,64.26 54.99,65.28 IC4.3
  Bottom 0.305: v56.01,60.07 56.01,53.85 48.39,46.23 v48.39,43.05
A3  (via drill 0.51)
  Top 0.305: IC5.26 46.74,42.29 40.13,42.29 37.97,44.45 37.97,48.13 R6.1 36.83,49.4 36.83,55.37 v34.16,58.04 | SJ3.2 12.32,67.31 15.49,64.14 19.3,64.14 19.68,64.52 19.68,66.93 20.07,67.31 21.59,67.31 22.48,66.42 22.48,61.6 | 22.48,61.6 24.51,59.56 24.51,58.04 | 24.51,58.04 24.51,57.28 23.75,56.52 U$1.6 | v15.62,55.25 10.03,49.66 C8.+ | v22.35,61.6 22.48,61.6 | 24.51,58.04 v24.89,58.04
  Bottom 0.305: v15.62,55.25 16,55.25 v22.35,61.6 | v24.89,58.04 v34.16,58.04
A6
  Top 0.305: JP6.3 52.32,53.09 52.32,44.58 IC5.19
A7
  Top 0.305: JP7.3 49.78,52.2 49.78,44.58 IC5.22
D2  (via drill 0.51)
  Top 0.305: v24.38,20.07 26.8,20.07 31.75,25.02 31.75,25.15 44.07,37.47 46.74,37.47 IC5.32
  Bottom 0.305: v24.38,20.07 24.38,8 SV2.8
D3  (via drill 0.51)
  Top 0.305: v45.85,33.53 45.85,33.66 48.13,35.94 IC5.1 | v33.66,24.51 v42.67,33.53
  Bottom 0.305: v42.67,33.53 v45.85,33.53 | v33.66,24.51 32.77,24.51 28.57,20.32 28.57,7.11 27.81,6.35 26.04,6.35 SV2.7
D4  (via drill 0.51)
  Top 0.305: v48.39,34.54 49.02,35.18 49.02,35.94 IC5.2 | v27.94,34.54 22.99,39.5 R2.1 | v42.8,57.91 42.8,67.56 45.59,70.36 47.37,70.36 51.18,66.55 IC4.2 | v46.36,44.83 v44.32,46.86
  Bottom 0.305: v27.94,34.54 46.36,34.54 | 46.36,34.54 v48.39,34.54 | v42.8,57.91 44.32,56.39 v44.32,46.86 | 46.36,34.54 v46.36,44.83
D5  (via drill 0.51)
  Top 0.305: v57.91,34.8 55.37,37.34 IC5.9 | v38.1,9.02 36.7,7.62 R4.1
  Bottom 0.305: v57.91,34.8 79.38,34.8 84.45,29.72 84.45,25.65 74.8,16 66.93,16 59.94,9.02 v38.1,9.02
D6  (via drill 0.51)
  Top 0.305: v63.5,38.23 55.37,38.23 IC5.10 | v69.85,37.59 70.99,38.74 IC3.6
  Bottom 0.305: v63.5,38.23 69.21,38.23 v69.85,37.59
D7  (via drill 0.51)
  Top 0.305: v53.85,37.47 53.85,38.35 54.48,38.99 55.25,38.99 IC5.11 | v61.09,11.56 62.23,10.41 IC2.5
  Bottom 0.305: v53.85,37.47 53.85,35.18 54.1,34.93 54.1,32.51 49.78,28.19
  Bottom 0.406: v61.09,11.56 59.94,12.7 57.15,12.7 50.8,19.05 50.8,20.32 48.26,20.32 48.26,26.67 49.78,28.19
D8
  Top 0.305: IC5.12 55.37,39.88 62.99,39.88 64.14,41.02 66.42,41.02 67.18,40.26 IC3.3
D9  (via drill 0.51)
  Top 0.305: v62.61,40.89 62.48,40.77 55.37,40.77 IC5.13 | v88.52,8.38 90.42,6.48 90.42,3.94 88.27,1.78 50.17,1.78 | 50.17,1.78 49.28,1.78 47.24,3.81 R24.1 | v50.17,6.48 50.67,6.48 52.07,7.87 IC2.41 | 50.17,1.78 v50.17,1.91
  Bottom 0.305: 72.9,43.43 88.52,27.81 v88.52,8.38 | v50.17,1.91 v50.17,6.48
  Bottom 0.406: 72.9,43.43 65.15,43.43 v62.61,40.89
D10  (via drill 0.51)
  Top 0.305: v58.42,54.61 58.42,43.69 56.26,41.53 55.37,41.53 IC5.14 | v17.14,67.56 17.14,66.67 16.26,65.79 Q3.1
  Bottom 0.305: v58.42,54.61 67.69,63.88 67.69,71.75 60.2,79.25 46.74,79.25 44.96,81.03 28.45,81.03 25.53,78.1 25.53,75.95 v17.14,67.56
D11  (via drill 0.51)
  Top 0.305: 29.72,64.14 31.24,64.14 31.62,64.52 31.62,66.93 32,67.31 33.53,67.31 33.91,66.93 33.91,63.25 42.29,54.86 43.43,54.86 45.72,57.15 56.52,57.15 57.28,56.39 57.28,43.43 56.13,42.29 55.37,42.29 IC5.15 | 29.72,64.14 28.19,65.66 Q1.1 | v24,53.09 24,54.23 29.72,59.94 29.72,64.14
  Bottom 0.305: SV1.4 20.07,29.08 18.41,30.73 18.41,47.5 v24,53.09
D12  (via drill 0.51)
  Top 0.305: v56.26,44.07 55.37,43.18 IC5.16 | v37.21,63.63 39.24,65.66 Q2.1
  Bottom 0.305: v56.26,44.07 56.26,44.32 55.37,45.21 54.61,45.21 49.4,40.01 49.4,34.16 | 22.1,29.59 21.34,28.83 21.34,27.05 | 21.34,27.05 SV1.1 | v37.21,63.63 27.3,63.63 17.78,54.1 17.78,28.83 19.56,27.05 21.34,27.05
  Bottom 0.406: 22.1,29.59 34.67,29.59 36.83,31.75 46.99,31.75 49.4,34.16
D13  (via drill 0.51)
  Top 0.305: v54.99,44.2 54.74,44.45 53.98,44.45 IC5.17 | SV1.3 21.34,27.05 19.56,27.05 19.18,26.67 9.14,26.67 R8.2
  Bottom 0.305: v54.99,44.2 54.99,40.01 50.04,35.05 50.04,33.91
  Bottom 0.406: 50.04,33.91 50.04,33.53 46.99,30.48 36.83,30.48 34.67,28.32 SV1.3
GND  (via drill 0.51, 0.6)
  Top 0.406: v55.88,11.43 55.88,11.18 | 50.55,16.51 v50.8,16.51
  Top 1.016: 57.15,25.91 55.88,25.91
  Top 1.27: Q1.3 32.77,65.66 32.77,57.4 R17.A 34.67,55.37 34.67,44.2 35.12,43.75 | 31.37,40.01 30.48,40.89 C24.2 30.1,41.4 29.59,41.91 JP4.2 | 31.37,40.01 32.89,38.48 C12.1 | 35.12,43.75 33.91,42.55 | 35.12,43.75 36.58,45.21 R3.2 | 33.91,42.55 31.37,40.01 | C23.2 35.56,40.89 33.91,42.55 | 74.99,63.18 78.36,66.55 IC1.3 76.96,64.39 83.38,57.98 | 74.99,63.18 74.68,62.87 74.68,61.09 C4.2 | 83.38,57.98 86.49,54.86 C2.- | 83.38,57.98 X5.2 | 60.83,64.01 61.34,64.52 64.39,64.52 C3.2 64.9,65.02 65.53,65.66 72.52,65.66 74.99,63.18 | 60.83,64.01 IC4.5 | 61.09,58.67 61.09,63.5 60.83,64.01 | 61.09,58.67 C5.1 61.6,55.25 64.01,52.83 64.01,52.45 65.02,51.44 67.18,51.44 68.45,50.17 IC3.13 IC3.4 68.45,36.2 68.01,35.75 | 54.74,72.9 J1.6 | J1.8 54.74,72.9 | 54.74,72.9 J1.7 | 44.07,65.66 44.07,62.99 46.99,60.07 | 46.99,60.07 JP7.1 JP6.1 C14.1 56.26,58.67 61.09,58.67 | 44.07,65.66 Q2.3 | 46.99,60.07 R16.A | v44.7,67.82 44.7,65.66 44.07,65.66 | C22.2 82.55,11.3 86.36,11.3 C21.2 | 78.49,5.08 R27.2 77.34,4.57 75.95,3.17 73.66,3.17 72.9,3.94 C11.1 | 78.49,5.08 R32.2 80.14,4.57 81.53,3.17 83.82,3.17 85.85,5.21 C9.2 | 78.49,5.08 78.49,5.59 81.28,8.38 R11.2 81.66,8.89 82.3,9.53 82.3,10.67 C22.2 | R23.2 78.87,35.56 78.74,35.69 C16.2 78.23,35.31 74.61,38.93 | 74.61,38.93 74.17,39.37 73.53,39.37 IC3.8 | 65.28,17.78 65.28,16.51 IC2.11 63.75,16.51 57.4,10.16 IC2.1 57.15,9.65 | 65.28,17.78 IC2.12 | 65.28,17.78 65.28,19.05 IC2.13 69.09,19.05 | 69.09,19.05 R25.A 75.44,18.8 76.45,18.8 80.01,15.24 80.01,13.72 82.04,11.68 C22.2 | 55.88,25.91 IC2.24 | IC2.23 57.15,25.91 58.04,25.91 | 58.04,25.91 58.42,25.91 IC2.22 | 58.04,25.91 58.04,30.48 R19.2 58.67,30.86 65.41,37.59 65.91,37.85
  Top 1.27: 72.14,33.27 SJ2.3 72.14,36.7 72.77,37.34 73.02,37.34 74.61,38.93 | 72.14,33.27 SJ1.1 | 71.06,32.7 71.63,33.27 72.14,33.27 | 71.06,32.7 69.09,30.73 C10.2 69.09,30.23 69.09,19.05 | 68.01,35.75 65.91,37.85 | 65.91,37.85 IC3.2 | 71.06,32.7 68.01,35.75 | 19.18,59.05 19.81,58.42 19.81,57.15 19.18,56.52 U$1.3 | 19.18,59.05 U$1.1 17.14,59.18 16.64,59.44 14.48,57.28 10.03,57.28 X3.2 9.53,54.23 7.37,52.07 6.98,51.56 5.59,50.17 5.21,49.66 | Q3.3 20.83,65.66 20.83,60.83 19.56,59.56 19.18,59.05 | 5.21,49.66 5.21,44.45 JP5.1 JP5.2 | 5.21,49.66 C8.- | 12.19,16.51 11.94,16.51 9.14,19.3 S1.4 8.89,19.94 7.24,21.59 7.24,23.88 4.83,26.29 DEBUG.C 5.33,27.3 6.35,28.32 16.13,28.32 18.67,30.86 SV1.6 | 12.19,16.51 ~NUDEV~1.GND | S1.3 9.14,12.95 12.19,16 12.19,16.51 | 57.15,9.65 55.88,9.65 IC2.44 | IC2.2 58.42,9.65 57.15,9.65 | IC2.44 55.88,5.33 R18.1 | 49.02,17.78 49.02,16.51 IC2.35 48.51,16.64 44.96,16.64 C20.1 44.45,16.26 43.31,15.11 C13.1 33.02,14.61 33.02,10.79 SV2.9 | 49.02,17.78 IC2.34 49.53,17.53 50.55,16.51 | IC2.33 49.02,19.05 49.02,17.78 | 55.88,11.18 IC2.44
  Bottom 1.27: J1.8 49.78,72.9 v44.7,67.82 | R17.A 35.69,55.88 37.21,54.36 38.99,54.36 40.64,56.01 R16.A | SV2.9 25.65,3.43 16.38,3.43 9.14,10.67 9.14,12.83 S1.3 | JP5.2 4.06,41.53 2.29,39.75 2.29,30.61 10.29,22.61 10.29,20.57 9.14,19.43 S1.4 | v50.8,16.51 v55.88,11.43
  pour Top: -1.27,86.36 101.6,86.36 101.6,-1.27 -1.27,-1.27
  pour Bottom: -1.27,86.36 101.6,86.36 101.6,-1.27 -1.27,-1.27
GNDA  (via drill 0.51)
  Top 0.305: 18.92,19.05 38.48,19.05 43.82,24.38 45.59,24.38 49.78,28.57 49.78,35.94 IC5.3 49.91,36.07 49.91,36.83 50.17,37.08 50.67,37.08 | 18.92,19.05 ~NUDEV~1.GNDA | 50.67,37.08 51.05,37.08 51.44,36.7 51.44,36.07 IC5.5 | 50.67,43.05 50.67,44.45 IC5.21 | 50.67,37.08 50.67,43.05 | POWER.C 6.86,71.88 2.79,67.82 2.79,12.06 4.06,10.79 10.79,10.79 18.92,18.92 18.92,19.05 | v80.39,72.52 C1.- | 50.67,43.05 v50.93,43.05
  Bottom 0.305: v50.93,43.05 v80.39,72.52
N$1  (via drill 0.51)
  Top 0.305: J1.1 64.77,75.44 | 64.77,75.44 68.2,75.44 R1.2 | v61.6,67.94 60.2,66.55 IC4.7 | JP1.2 64.77,75.56 64.77,75.44
  Bottom 0.305: v61.6,67.94 61.6,71.75 62.36,72.52 J1.1
N$2
  Top 0.305: R1.1 68.2,72.64 61.34,72.64 J1.2 61.09,75.82 60.2,76.71 56.01,76.71 | 56.01,76.71 56.01,80.77 JP1.1 | 56.01,76.71 56.01,75.06 57.28,73.79 57.28,66.55 58.55,65.28 IC4.6
N$3  (via drill 0.51)
  Top 0.762: 85.85,19.94 88.14,17.65 LED4.A 88.39,17.27 89.66,16 X4.1 | 85.85,19.94 85.72,20.07 LED2.C | v73.15,10.03 72.9,9.78 63.5,9.78 IC2.6 | v85.22,19.3 85.85,19.94
  Bottom 0.762: v73.15,10.03 74.42,10.03 83.69,19.3 v85.22,19.3
N$4  (via drill 0.51)
  Top 0.762: X4.2 92.58,23.11 84.33,23.11 82.04,20.83 R13.2 | v50.55,7.75 50.8,8 IC2.40
  Bottom 0.762: v50.55,7.75 72.9,7.75 75.82,4.83 86.61,4.83 91.82,10.03 91.82,18.29 X4.2
N$5  (via drill 0.51)
  Top 0.305: C19.1 39.5,3.81 39.5,7.62 R4.2 39.5,7.75 v39.5,13.59 | v46.23,20.32 47.5,21.59 IC2.31
  Bottom 0.305: v39.5,13.59 v46.23,20.32
N$6  (via drill 0.6)
  Top 0.406: 72.26,41.78 72.39,41.91
  Top 0.813: IC3.7 72.26,41.78
  Top 1.016: 72.39,41.91 v76.2,41.91 | v87.63,38.1 LED3.C
  Top 1.27: LED8.A 85.6,42.55 87.5,42.55 87.63,42.67 LED3.C 88.14,43.05 90.04,43.05 X2.2
  Bottom 1.016: v76.2,41.91 80.01,38.1 v87.63,38.1
N$7
  Top 0.305: 84.2,17.65 82.17,17.65 82.04,17.78 R13.1 | 84.2,17.65 85.72,17.65 LED2.A | LED4.C 88.14,21.08 87.88,21.08 86.74,22.22 84.71,22.22 84.2,21.72 84.2,17.65
N$8  (via drill 0.51)
  Top 0.305: v5.84,21.97 4.83,22.99 DEBUG.A | v8.89,21.97 8.89,23.37 9.14,23.62 R8.1
  Bottom 0.305: v5.84,21.97 v8.89,21.97
N$9  (via drill 0.51)
  Top 0.305: C9.1 89.15,5.21 85.98,8.38 R11.1 84.33,8.26 v84.33,5.97 | v67.31,14.99 67.06,15.24 IC2.10
  Bottom 0.305: v67.31,14.99 67.31,14.48 75.82,5.97 v84.33,5.97
N$11
  Top 0.305: C5.2 61.09,52.58 62.36,52.58 64.64,50.29 65.02,50.29 65.91,49.4 IC3.15
N$12  (via drill 0.51)
  Top 0.305: 80.52,32.89 78.74,32.89 C16.1 | 80.52,32.89 83.31,32.89 85.98,35.56 R23.1 | v67.69,20.83 66.93,21.59 IC2.15 | v73.41,25.65 80.52,32.77 80.52,32.89
  Bottom 0.305: v67.69,20.83 68.58,20.83 v73.41,25.65
N$13
  Top 0.305: C6.2 66.29,53.85 69.72,50.42 IC3.12
N$14
  Top 0.305: C6.1 68.71,53.85 68.71,52.32 70.99,50.04 IC3.11
N$15  (via drill 0.51)
  Top 0.305: v70.23,53.47 72.26,55.5 C7.1 | v67.06,46.74 67.06,48.51 67.18,48.64 IC3.14
  Bottom 0.305: v70.23,53.47 70.23,49.91 v67.06,46.74
N$16
  Top 0.305: IC3.5 69.72,40.26 70.48,44.83 75.44,44.83 80.77,39.5 R5.2
N$17  (via drill 0.51)
  Top 0.762: 77.34,46.23 73.66,46.23 72.26,47.62 IC3.10 | 77.34,46.23 R14.1 | v78.87,44.45 77.34,45.97 77.34,46.23
  Bottom 0.762: X2.1 81.41,41.91 v78.87,44.45
N$18
  Top 0.762: C11.2 60.2,3.94 60.07,3.81 R18.2 59.69,4.06 IC2.3
N$20  (via drill 0.51)
  Top 0.305: v51.31,47.75 51.44,47.62 51.44,44.58 IC5.20 | v55.75,52.2 C14.2
  Bottom 0.305: v51.31,47.75 v55.75,52.2
N$21
  Top 0.305: JP5.5 R10.1
N$22
  Top 0.305: JP5.4 R9.1
N$23
  Top 0.305: LED9.C 87.63,27.56 85.09,27.56 LED1.A 84.96,27.56 84.45,28.07 81.28,28.07 R22.1
N$24
  Top 0.305: LED3.A 87.63,46.1 87.5,45.97 85.6,45.97 LED8.C 85.47,45.97 85.22,46.23 R14.2
N$25
  Top 0.305: POWER.A 5.84,71.88 7.11,73.15 11.18,73.15 12.45,71.88 R15.1
N$26  (via drill 0.51)
  Top 0.762: v83.44,29.34 84.84,30.73 LED1.C 85.09,30.99 87.63,30.99 LED9.A 87.88,31.24 X4.4 | IC2.28 v50.8,27.81
  Bottom 0.762: v50.8,27.81 81.91,27.81 v83.44,29.34
N$27  (via drill 0.51)
  Top 0.762: X4.3 93.73,25.27 81.28,25.27 R22.2 81.03,25.53 v79.88,26.67 | v67.69,25.91 63.5,25.91 IC2.18
  Bottom 0.762: v67.69,25.91 69.09,25.91 69.98,26.8 79.76,26.8 v79.88,26.67
N$28  (via drill 0.51)
  Top 0.305: v82.8,6.98 82.8,5.08 R32.1 | v60.33,35.81 53.34,28.83 IC2.26
  Bottom 0.305: v82.8,6.98 82.8,10.16 86.23,13.59 86.23,29.21 79.63,35.81 v60.33,35.81
N$30
  Top 0.762: C10.1 64.14,30.73 63.88,30.48 R19.1 63.5,30.73 59.69,26.92 IC2.21
N$31  (via drill 0.51)
  Top 0.305: v53.09,34.54 53.09,35.94 IC5.7 | Q4.2 30.1,26.04 C12.2
  Bottom 0.406: Q4.2 33.15,25.53 36.83,29.21 46.99,29.21 52.07,34.29 52.83,34.29 v53.09,34.54
N$32  (via drill 0.51)
  Top 0.305: v53.09,33.15 54.1,34.16 54.1,34.93 53.98,35.05 53.98,35.94 IC5.8 | v30.61,16.89 C13.2
  Bottom 0.305: v53.09,33.15 52.58,33.15 | v30.61,16.89 Q4.1
  Bottom 0.406: Q4.1 30.86,20.7 38.1,27.94 46.99,27.94 52.07,33.02 52.96,33.02 v53.09,33.15
N$33
  Top 1.27: 44.32,72.52 42.16,72.52 41.66,72.01 Q2.4 Q2.2 | 44.32,72.52 46.48,72.52 LED7.C | 44.32,72.52 X1.1
N$34
  Top 1.27: 34.16,72.64 31.11,72.64 30.48,72.01 Q1.4 Q1.2 | 34.16,72.64 35.31,72.64 LED6.C | 34.16,72.64 X1.3
N$35
  Top 1.27: Q3.2 Q3.4 19.05,72.26 23.5,72.26 LED5.C X1.5
N$36  (via drill 0.51)
  Top 0.305: v46.36,21.84 45.59,22.61 44.45,22.61 C18.1 | v47.24,14.61 47.62,14.61 48.26,15.24 IC2.36
  Bottom 0.305: v46.36,21.84 46.36,21.59 47.24,20.7 v47.24,14.61
N$37
  Top 0.305: C20.2 44.45,19.3 47.24,19.3 48.26,20.32 IC2.32
N$38
  Top 0.305: C17.2 44.45,12.95 47.24,12.95 48.26,13.97 IC2.37
N$39
  Top 0.305: C17.1 44.45,10.03 45.59,10.03 48.26,12.7 IC2.38
N$41
  Top 0.305: R31.1 LED5.A
N$42
  Top 0.305: LED6.A 35.31,67.18 35.43,67.06 R29.1
N$43
  Top 0.305: LED7.A 46.48,67.44 46.61,67.31 R30.1
N$45  (via drill 0.51)
  Top 0.305: R27.1 74.8,5.08 74.8,8.89 R26.2 | v83.95,12.7 82.55,14.1 C22.1 | v76.58,10.54 74.93,8.89 R26.2 | IC2.9 70.74,13.97 75.31,9.4 R26.2
  Bottom 0.305: v83.95,12.7 78.74,12.7 v76.58,10.54
N$46  (via drill 0.51)
  Top 0.305: v73.66,30.1 SJ1.2 | v70.48,24.13 v75.31,28.96 | v63.25,22.35 63.25,24.13 62.23,25.15 IC2.19
  Bottom 0.305: v73.66,30.1 74.17,30.1 v75.31,28.96 | v70.48,24.13 68.2,21.84 63.75,21.84 v63.25,22.35
N$47  (via drill 0.51)
  Top 0.305: v73.66,33.78 SJ2.2 | v65.53,28.96 64.01,27.43 61.72,27.43 60.96,26.67 IC2.20
  Bottom 0.305: v73.66,33.78 70.36,33.78 v65.53,28.96
N$48  (via drill 0.51)
  Top 0.305: v74.8,17.4 78.23,13.97 R28.2
  Bottom 0.305: v74.8,17.4 73.79,18.41 73.79,22.99 R25.E
N$49  (via drill 0.51)
  Top 0.305: R25.S 75.82,21.59 80.77,16.64 82.55,16.64 84.96,14.22 86.36,14.22 C21.1 | v63.37,20.19 63.5,20.32 IC2.14
  Bottom 0.305: v63.37,20.19 65.91,20.19 66.93,19.18 69.98,19.18 R25.S
RESET  (via drill 0.51)
  Top 0.305: S1.1 4.57,12.95 4.57,19.3 S1.2 4.57,19.43 4.57,21.59 3.56,22.61 3.56,27.94 5.59,29.97 11.68,29.97 13.08,31.37 C15.1 17.65,31.37 18.41,32.13 23.75,32.13 23.75,32 | 23.75,32 30.99,32 31.37,31.62 31.37,29.84 32,29.21 33.78,29.21 34.16,29.59 34.16,32.38 41.53,39.75 46.74,39.75 IC5.29 | 23.75,32 SV1.5 | v19.43,34.04 14.48,38.99 R7.1
  Bottom 0.305: SV1.5 v19.43,34.04
RTS#
  Top 0.305: JP5.6 C15.2
RX  (via drill 0.51)
  Top 0.305: v41.28,38.1 42.16,38.99 46.74,38.99 IC5.30 | v21.46,38.1 16.51,38.1 14.22,40.39 | 14.22,40.39 12.32,40.39 11.94,40.01 11.94,37.72 13.21,36.45 R9.2 | v33.27,70.48 35.18,70.48 40.77,76.07 40.77,78.1 43.69,81.03 44.96,81.03 45.85,80.14 45.85,78.87 54.1,70.61 54.1,67.82 IC4.1 | v14.35,40.64 14.22,40.51 14.22,40.39
  Bottom 0.305: v21.46,38.1 v41.28,38.1 | v33.27,70.48 14.35,51.56 v14.35,40.64
SCL  (via drill 0.51)
  Top 0.305: v37.34,40.77 46.74,40.77 IC5.28 | JP4.4 22.86,44.07 R21.1 | v22.99,50.17 22.99,55.25 U$1.5
  Bottom 0.305: v37.34,40.77 29.46,40.77 JP4.4 24.51,45.85 22.99,47.37 v22.99,50.17
SDA  (via drill 0.51)
  Top 0.305: v37.97,42.04 38.48,41.53 46.74,41.53 IC5.27 | 21.34,49.28 22.48,49.28 24,47.75 25.02,47.75 JP4.3 | R20.1 21.34,49.28 | U$1.7 22.1,57.79 21.34,57.02 21.34,49.28
  Bottom 0.305: v37.97,42.04 30.73,42.04 JP4.3
TCPL  (via drill 0.51)
  Top 0.305: SJ3.1 4.32,66.8 9.14,61.98 X3.1 | v15.75,56.52 15.75,56.64 16.89,57.79 U$1.2
  Bottom 0.305: v15.75,56.52 10.29,61.98 X3.1
TX  (via drill 0.51)
  Top 0.305: v40.13,35.56 42.8,38.23 46.74,38.23 IC5.31 46.86,38.35 47.62,38.35 49.4,40.13 v49.4,41.4 | v22.35,35.56 19.81,33.02 14.22,33.02 13.33,33.91 R10.2 | v54.99,62.48 54.23,63.25 54.23,64.01 IC4.4
  Bottom 0.305: v22.35,35.56 v40.13,35.56 | v54.99,62.48 57.02,60.45 57.02,50.55 49.4,42.93 v49.4,41.4
VCC  (via drill 0.51)
  Top 0.305: JP5.3 R7.2 10.41,39.12 10.41,39.37 15.62,44.58 R21.2 | R2.2 19.94,39.5 19.94,39.88 15.75,44.07 R21.2 | R21.2 15.75,44.2 15.75,49.28 R20.2 15.75,49.4 17.65,51.31 17.65,54.1 | 17.65,54.1 17.65,55.25 U$1.4 | IC2.42 53.34,8.26 50.29,5.21 45.85,5.21 44.45,3.81 R24.2 42.04,3.81 40.51,2.29 38.23,2.29 36.7,3.81 C19.2 26.8,3.81 26.04,4.57 26.04,5.59 27.3,6.86 SV2.10 | R26.1 77.6,8.89 77.6,11.81 75.44,13.97 R28.1 75.31,13.97 v71.63,17.65 | SJ2.1 SJ1.3 75.18,30.23 74.04,29.08 73.91,29.08 v70.48,25.65 | v67.69,22.86 IC2.16 | 51.94,34.93 50.93,34.93 50.67,35.18 50.67,35.94 IC5.4 | 51.94,34.93 52.2,35.18 52.2,35.94 IC5.6 52.32,36.07 52.32,37.34 52.96,37.97 52.96,44.45 IC5.18 53.09,44.7 53.09,51.31 54.61,52.83 54.61,53.85 JP6.2 | 51.94,34.93 52.07,34.93 IC2.27 52.07,25.15 v51.94,22.73 | 39.62,52.32 39.62,52.58 37.85,54.36 R16.E | 39.62,52.32 R6.2 | v59.31,68.96 59.31,67.82 IC4.8 | JP7.2 45.47,55.88 41.91,52.32 39.62,52.32 | v66.17,64.26 70.99,64.26 IC1.2 71.25,64.26 71.25,61.47 71.63,61.09 C4.1 72.26,61.09 78.49,54.86 C2.+ 78.61,54.74 79.88,53.47 79.88,45.21 85.22,39.88 85.22,39.5 R5.1 | 17.65,54.1 v20.32,54.1
  Bottom 0.305: SV2.10 27.3,18.54 SV1.2 19.94,25.78 6.73,38.99 JP5.3 | 68.13,23.3 v70.48,25.65 | 68.13,23.3 v67.69,22.86 | v71.63,17.65 64.52,17.65 62.23,19.94 62.23,22.73 | 62.23,22.73 62.87,23.37 68.07,23.37 68.13,23.3 | 29.21,54.1 29.21,48.64 JP4.1 | 29.21,54.1 R17.E 32.64,55.88 33.78,57.02 36.83,57.02 R16.E | 59.31,68.2 v59.31,68.96 | 59.31,68.2 53.98,62.87 53.98,59.56 54.61,58.93 54.61,57.91 JP6.2 JP7.2 | v66.17,64.26 63.37,64.26 59.44,68.2 59.31,68.2 | v51.94,22.73 62.23,22.73 | v20.32,54.1 29.21,54.1

### Text on the board
tPlace: A+ | A- | B+ | B- | C+ | C- | RS485 | NOT ETHERNET | POWER | RS485 | THERMOCOUPLE/ | 0v | THERMISTOR | +12v | 12V POWER | W | A7 | A6 | A0 | - | G | + | + | - | - | TEMPERATURE | + | + | make.rrrf.org/ec-2.3 | Design: Zach & Adrian | I2C | BLK | GND | BRN | CTS# | H BRIDGE | RED | c RRRF.org 2009 | VCC | ORG | ICSP | TXD | MICROSTEP | YEL | Extruder Controller | RXD | GRN | RTS# | V2.3 | Serial - USB<>TTL | License: GPL v3.0 | STEPPER | CURRENT | GND BRIDGE | RESET | QUADRATURE
tNames: A1